# Altium schematic sheet E-14 ENET1.SchDoc: FRDM-IMX93
size 513 x 386 mm; DrawnBy: FORLINX; Organization: ORGANIZATION; Address1: ADDRESS 1; Address2: ADDRESS 2; Address3: ADDRESS 3; Address4: ADDRESS 4; Revision: -; ENG_APP_DATE: --/--/--; DSN_APP_DATE: --/--/--; CHK_APP_DATE: --/--/--; Classification: Public, Company Internal/Proprietary, Company Confidential,  Company Secret; Page Create Date: March  8, 1995; OrgName: NXP Semiconductor; FIUO: A; OrgAddr1: NO. 192 Liangjing Rd. Pudong New Area, ShangHai; Page Number: 14; PageTitle: ENET1; Page Size: C; Page Count: 23; Designer: FORLINX; RevCode: B1; Approver: NXP SE; Doc: SCH-94611 PDF: SPF-94611; DsnPath: T:\FILES\Designs\Single Board Computers\i.MX93-FRDM\Design Files\SCH-94611_B1.DSN; SchematicName: FRDM-i.MX 93 Development Board; PageName: E-14 ENET1; PageSize: C; TopSchematic: True
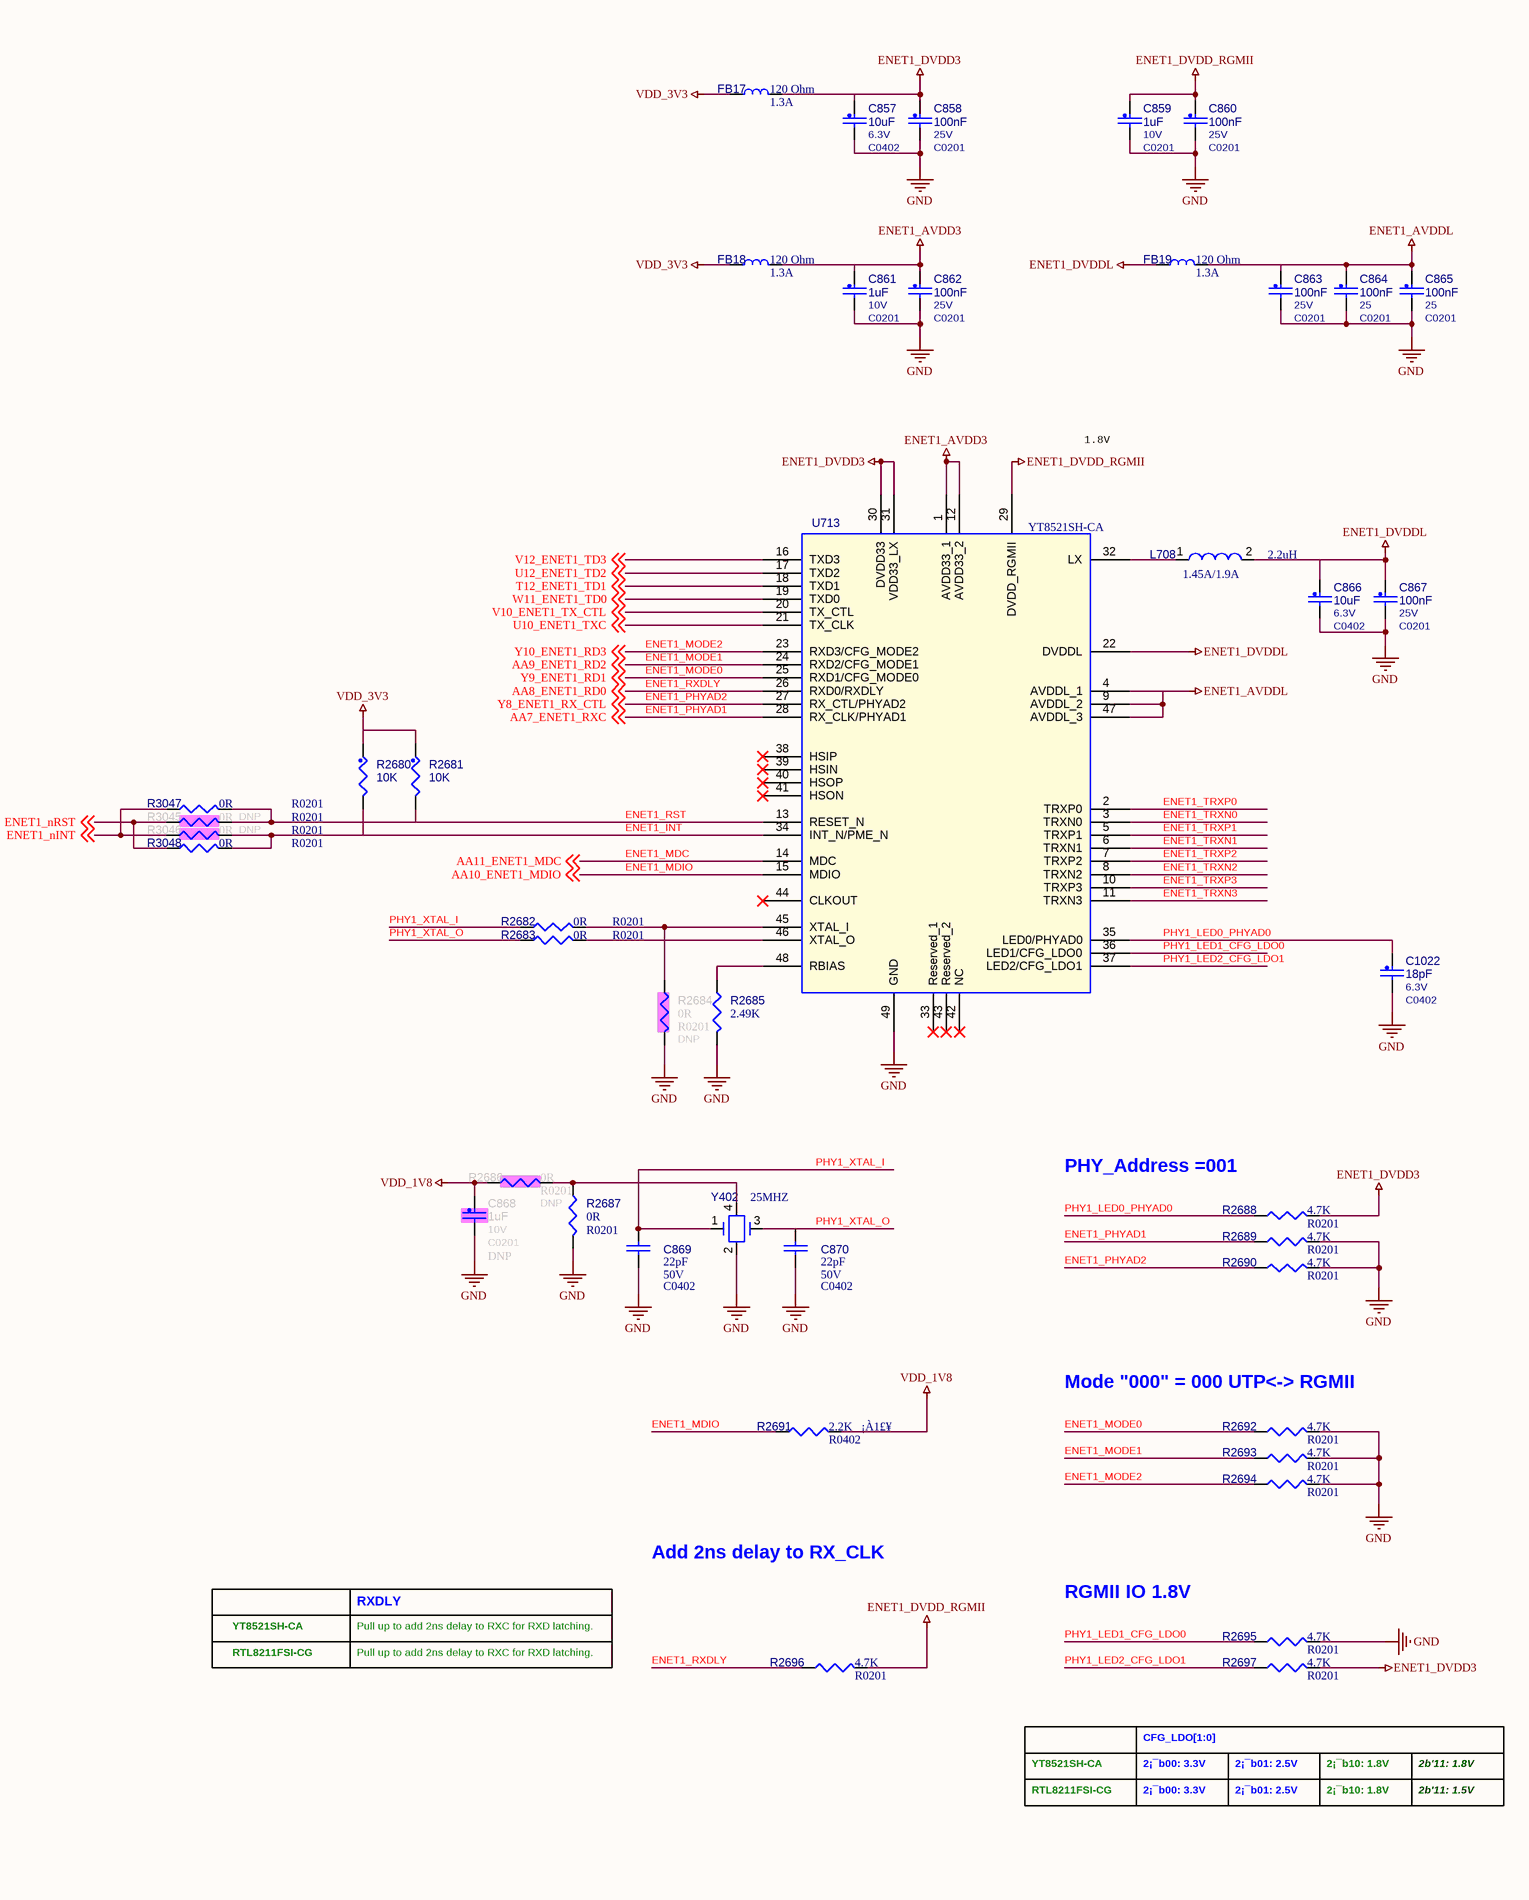
[diagram p0: E-14 ENET1.SchDoc, left]
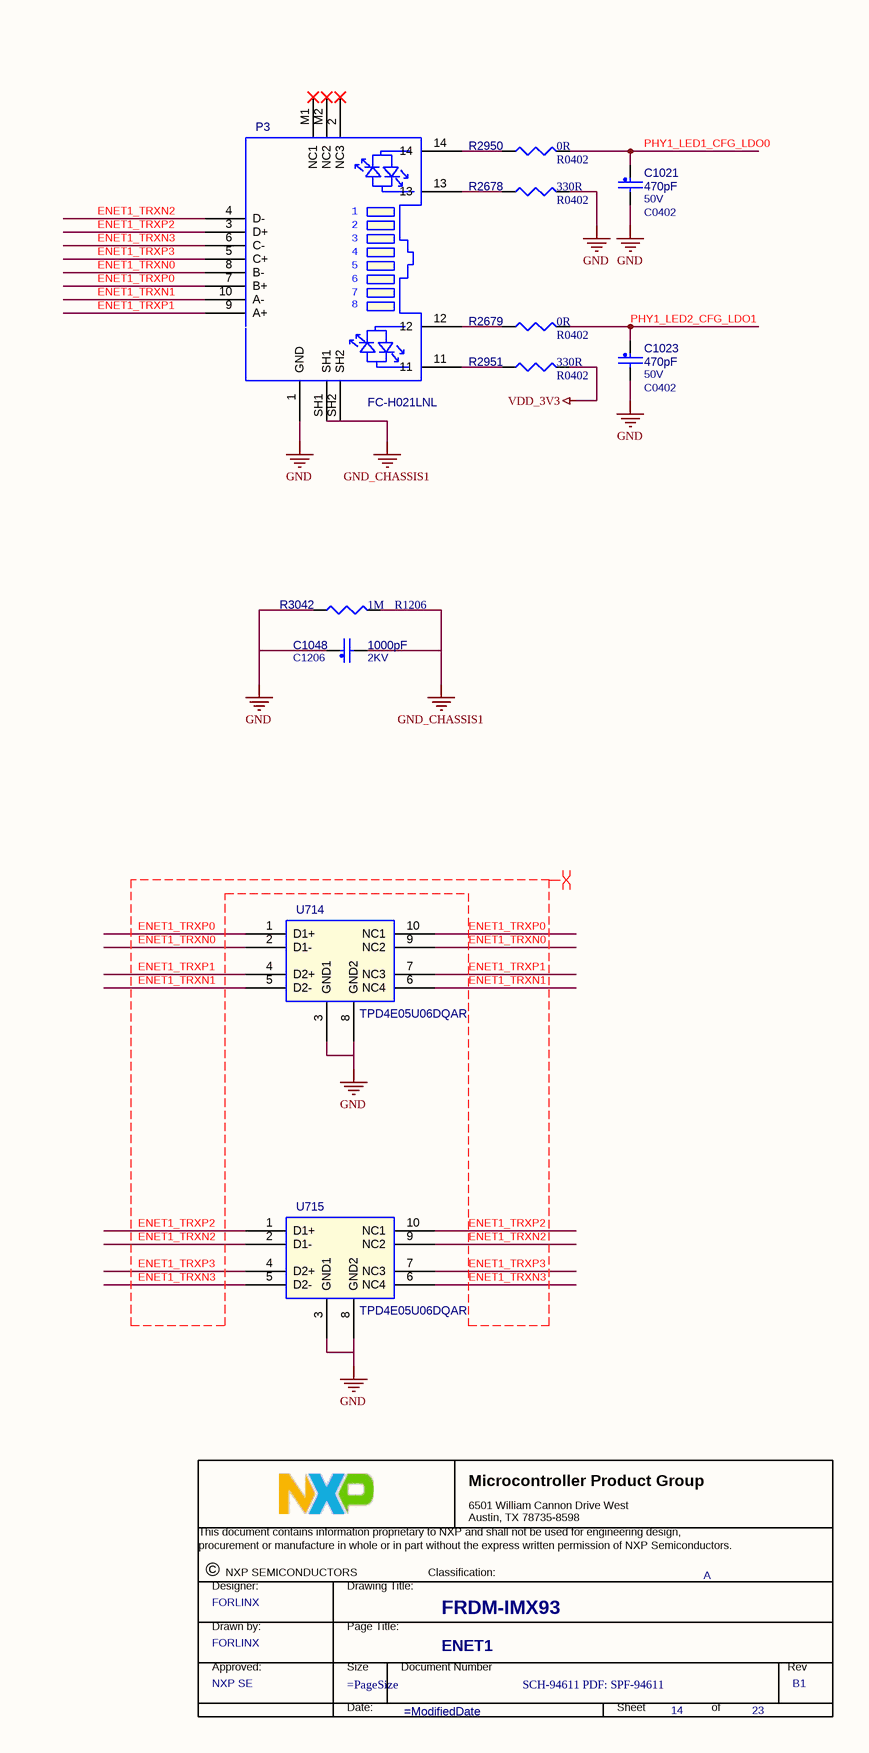
[diagram p1: E-14 ENET1.SchDoc, right]

## Parts
*  Title: FRDM-IMX93  RevCode: B1  PageTitle: ENET1  Page Number: 14  Page Count: 23  DrawnBy: FORLINX  Doc: SCH-94611 PDF: SPF-94611  Approver: NXP SE  FIUO: A  (graphical)
C857  10uF  VOLTAGE: 6.3V  [C0402]
C858  100nF  VOLTAGE: 25V  [C0201]
C859  1uF  VOLTAGE: 10V  [C0201]
C860  100nF  VOLTAGE: 25V  [C0201]
C861  1uF  VOLTAGE: 10V  [C0201]
C862  100nF  VOLTAGE: 25V  [C0201]
C863  100nF  VOLTAGE: 25V  [C0201]
C864  100nF  VOLTAGE: 25  [C0201]
C865  100nF  VOLTAGE: 25  [C0201]
C866  10uF  VOLTAGE: 6.3V  [C0402]
C867  100nF  VOLTAGE: 25V  [C0201]
C868  1uF  ASSY_OPT: DNP  VOLTAGE: 10V  [C0201]
C869  22pF  Voltage: 50V  [C0402]
C870  22pF  Voltage: 50V  [C0402]
C1021  470pF  VOLTAGE: 50V  [C0402]
C1022  18pF  VOLTAGE: 6.3V  [C0402]
C1023  470pF  VOLTAGE: 50V  [C0402]
C1048  1000pF  VOLTAGE: 2KV  [C1206]
FB17  120 Ohm  electric current: 1.3A  [FB0402]
FB18  120 Ohm  electric current: 1.3A  [FB0402]
FB19  120 Ohm  electric current: 1.3A  [FB0402]
L708  2.2uH  electric current: 1.45A/1.9A  [IND_2016A]
P3  FC-H021LNL  [RJ45-Gigabit]
R2678  330R  [R0402]
R2679  0R  [R0402]
R2680  10K  [R0201]
R2681  10K  [R0201]
R2682  0R  [R0201]
R2683  0R  [R0201]
R2684  0R  ASSY_OPT: DNP  [R0201]
R2685  2.49K  [R0402]
R2686  0R  ASSY_OPT: DNP  [R0201]
R2687  0R  [R0201]
R2688  4.7K  [R0201]
R2689  4.7K  [R0201]
R2690  4.7K  [R0201]
R2691  2.2K  precision: ¡À1£¥  [R0402]
R2692  4.7K  [R0201]
R2693  4.7K  [R0201]
R2694  4.7K  [R0201]
R2695  4.7K  [R0201]
R2696  4.7K  [R0201]
R2697  4.7K  [R0201]
R2950  0R  [R0402]
R2951  330R  [R0402]
R3042  1M  [R1206]
R3045  0R  ASSY_OPT: DNP  [R0201]
R3046  0R  ASSY_OPT: DNP  [R0201]
R3047  0R  [R0201]
R3048  0R  [R0201]
U713  YT8521SH-CA  [QFN48P_0_4BSC_6x6_H]
U714  TPD4E05U06DQAR  [USON-10]
U715  TPD4E05U06DQAR  [USON-10]
Y402  25MHZ  [xtlosc4_3p2x2p5mm_sm]

## Nets
ENET1_AVDD3: C861.1 C862.1 FB18.2 U713.1(AVDD33_1) U713.12(AVDD33_2)
ENET1_AVDDL: C863.1 C864.1 C865.1 FB19.2 U713.4(AVDDL_1) U713.9(AVDDL_2) U713.47(AVDDL_3)
ENET1_DVDD3: C857.1 C858.1 FB17.2 R2688.2 R2697.2 U713.30(DVDD33) U713.31(VDD33_LX)
ENET1_DVDD_RGMII: C859.1 C860.1 R2696.2 U713.29(DVDD_RGMII)
ENET1_DVDDL: C866.1 C867.1 FB19.1 L708.2 U713.22(DVDDL)
GND: C857.2 C858.2 C859.2 C860.2 C861.2 C862.2 C863.2 C864.2 C865.2 C866.2 C867.2 C868.2 C869.2 C870.2 C1021.2 C1022.2 C1023.2 C1048.1 P3.1(GND) R2678.2 R2684.2 R2685.2 R2687.2 R2689.2 R2690.2 R2692.2 R2693.2 R2694.2 R2695.2 R3042.1 U713.49(GND) U714.3(GND1) U714.8(GND2) U715.3(GND1) U715.8(GND2) Y402.2
GND_CHASSIS1: C1048.2 P3.SH1 P3.SH2 R3042.2
VDD_1V8: C868.1 R2686.1 R2691.2
VDD_3V3: FB17.1 FB18.1 R2680.1 R2681.1 R2951.2
ENET1_INT: R2680.2 R3046.2 R3048.2 U713.34(INT_N/PME_N)
ENET1_MDC: U713.14(MDC) ; off-sheet AA11_ENET1_MDC  [also labelled AA11_ENET1_MDC]
ENET1_MDIO: R2691.1 U713.15(MDIO) ; off-sheet AA10_ENET1_MDIO  [also labelled AA10_ENET1_MDIO]
ENET1_MODE0: R2692.1 U713.25(RXD1/CFG_MODE0) ; off-sheet Y9_ENET1_RD1  [also labelled Y9_ENET1_RD1]
ENET1_MODE1: R2693.1 U713.24(RXD2/CFG_MODE1) ; off-sheet AA9_ENET1_RD2  [also labelled AA9_ENET1_RD2]
ENET1_MODE2: R2694.1 U713.23(RXD3/CFG_MODE2) ; off-sheet Y10_ENET1_RD3  [also labelled Y10_ENET1_RD3]
ENET1_nINT: R3046.1 R3047.1 ; off-sheet ENET1_nINT
ENET1_nRST: R3045.1 R3048.1 ; off-sheet ENET1_nRST
ENET1_PHYAD1: R2689.1 U713.28(RX_CLK/PHYAD1) ; off-sheet AA7_ENET1_RXC  [also labelled AA7_ENET1_RXC]
ENET1_PHYAD2: R2690.1 U713.27(RX_CTL/PHYAD2) ; off-sheet Y8_ENET1_RX_CTL  [also labelled Y8_ENET1_RX_CTL]
ENET1_RST: R2681.2 R3045.2 R3047.2 U713.13(RESET_N)
ENET1_RXDLY: R2696.1 U713.26(RXD0/RXDLY) ; off-sheet AA8_ENET1_RD0  [also labelled AA8_ENET1_RD0]
ENET1_TRXN0: P3.8(B-) U713.3(TRXN0) U714.2(D1-) U714.9(NC2)
ENET1_TRXN1: P3.10(A-) U713.6(TRXN1) U714.5(D2-) U714.6(NC4)
ENET1_TRXN2: P3.4(D-) U713.8(TRXN2) U715.2(D1-) U715.9(NC2)
ENET1_TRXN3: P3.6(C-) U713.11(TRXN3) U715.5(D2-) U715.6(NC4)
ENET1_TRXP0: P3.7(B+) U713.2(TRXP0) U714.1(D1+) U714.10(NC1)
ENET1_TRXP1: P3.9(A+) U713.5(TRXP1) U714.4(D2+) U714.7(NC3)
ENET1_TRXP2: P3.3(D+) U713.7(TRXP2) U715.1(D1+) U715.10(NC1)
ENET1_TRXP3: P3.5(C+) U713.10(TRXP3) U715.4(D2+) U715.7(NC3)
PHY1_LED0_PHYAD0: C1022.1 R2688.1 U713.35(LED0/PHYAD0)
PHY1_LED1_CFG_LDO0: C1021.1 R2695.1 R2950.2 U713.36(LED1/CFG_LDO0)
PHY1_LED2_CFG_LDO1: C1023.1 R2679.2 R2697.1 U713.37(LED2/CFG_LDO1)
PHY1_XTAL_I: C869.1 R2682.1 Y402.1
PHY1_XTAL_O: C870.1 R2683.1 Y402.3
T12_ENET1_TD1: U713.18(TXD1) ; off-sheet T12_ENET1_TD1
U10_ENET1_TXC: U713.21(TX_CLK) ; off-sheet U10_ENET1_TXC
U12_ENET1_TD2: U713.17(TXD2) ; off-sheet U12_ENET1_TD2
V10_ENET1_TX_CTL: U713.20(TX_CTL) ; off-sheet V10_ENET1_TX_CTL
V12_ENET1_TD3: U713.16(TXD3) ; off-sheet V12_ENET1_TD3
W11_ENET1_TD0: U713.19(TXD0) ; off-sheet W11_ENET1_TD0
NetL708_1: L708.1 U713.32(LX)
NetP3_11: P3.11 R2951.1
NetP3_12: P3.12 R2679.1
NetP3_13: P3.13 R2678.1
NetP3_14: P3.14 R2950.1
NetR2682_2: R2682.2 R2684.1 U713.45(XTAL_I)
NetR2683_2: R2683.2 U713.46(XTAL_O)
NetR2685_1: R2685.1 U713.48(RBIAS)
NetR2686_2: R2686.2 R2687.1 Y402.4

Not connected (* = marked no-connect by the designer): P3 2(NC3)* M1(NC1)* M2(NC2)*; U713 33(Reserved_1)* 38(HSIP)* 39(HSIN)* 40(HSOP)* 41(HSON)* 42(NC)* 43(Reserved_2)* 44(CLKOUT)*

## Layout directives
differential pair: ENET1_TRXN0, ENET1_TRXN1, ENET1_TRXN2, ENET1_TRXN3, ENET1_TRXP0, ENET1_TRXP1, ENET1_TRXP2, ENET1_TRXP3

## Notes on the sheet
- 1.8V
- PHY_Address =001
- (near R2692) Mode "000" = 000 UTP<-> RGMII
- Add 2ns delay to RX_CLK
- YT8521SH-CA
- RXDLY
- Pull up to add 2ns delay to RXC for RXD latching.
- RGMII IO 1.8V
- RTL8211FSI-CG
- CFG_LDO[1:0]
- 2¡¯b00: 3.3V
- 2¡¯b01: 2.5V
- 2¡¯b10: 1.8V
- 2b'11: 1.8V
- 2b'11: 1.5V
- DWG. NO.
- REV.
- SHT.
- REVISION
- DESCRIPTION
- DATE
- APPROVED
- ENG:
- APPROVALS
- quilter.ai <http://quilter.ai>
- DSN:
- CHK:
- REFERENCE DOCUMENTS
- TITLE
- PROJECT
- BOM:
- FAB DWG:
- PCB DWG:
- ASSY DWG:
- SIZE
- FILE NAME
- C
- DWG NO.
- SHEET
- OF
- REV
- (in symbol TitleBlock_MCPG) Microcontroller Product Group; 6501 William Cannon Drive West / Austin, TX 78735-8598; This document contains information proprietary to NXP and shall not be used for engineering design,; procurement or manufacture in whole or in part without the express written permission of NXP Semiconductors.; ©; NXP SEMICONDUCTORS; Classification:; Designer:; Drawing Title:; Drawn by:; Page Title:; Approved:; Size; Document Number; Rev; Date:; Sheet; of

## Library data of the parts
* = TitleBlock_MCPG: Classification: Public, Company Internal/Proprietary, Company Confidential,  Company Secret; OrgAddr1: NO. 192 Liangjing Rd. Pudong New Area, ShangHai; OrgName: NXP Semiconductor; Page Size: =PageSize; Page Create Date: March  8, 1995; Designer: FORLINX; Page Modify Date: =ModifiedDate
C857 = CAP_NP: 0402,10uF,6.3V,+/-20%,X5R; Part Reference: C857; CLASS: DISCRETE; Tolerance: 20%; MFG_NAME01: FENGHUA; MFG_PN01: 0402X106M6R3NT; CAD_APPROVED: Yes; FPLIST: CC0402_25,CC0402_HD,0402_CC; Value: 10uF; ROHS: Yes; HEIGHT: 0.65 MM; PCB Footprint: C0402
C858 = CAP_NP: 0201,100nF,25V,+/-10%,X5R; Part Reference: C858; CLASS: DISCRETE; FPLIST: CC0402_25,CC0402_HD,0402_CC; CAD_APPROVED: Yes; MFG_PN01: 0201X104K250NT; MFG_NAME01: FENGHUA; Tolerance: 20%; Value: 100nF; HEIGHT: 0.65 MM; ROHS: Yes; PCB Footprint: C0201
C859 = CAP_NP: 0201,1uF,10V,+/-20%,X5R; Part Reference: C859; CLASS: DISCRETE; FPLIST: CC0201,CC0201_HD,0201_CC,0201_CC_012SM_NSP; CAD_APPROVED: Yes; MFG_PN01: CL03A105MP3NSNC; MFG_NAME01: SAMSUNG; Tolerance: 20%; Value: 1uF; Package Type: 7¡± reel; Package Size: 0201; HEIGHT: 0.35MM; ROHS: Yes; PCB Footprint: C0201
C860 = CAP_NP: 0201,100nF,25V,+/-10%,X5R; Part Reference: C860; CLASS: DISCRETE; Tolerance: 20%; MFG_NAME01: FENGHUA; MFG_PN01: 0201X104K250NT; CAD_APPROVED: Yes; FPLIST: CC0402_25,CC0402_HD,0402_CC; Value: 100nF; ROHS: Yes; HEIGHT: 0.65 MM; PCB Footprint: C0201
C861 = CAP_NP: 0201,1uF,10V,+/-20%,X5R; Part Reference: C861; CLASS: DISCRETE; Tolerance: 20%; MFG_NAME01: SAMSUNG; MFG_PN01: CL03A105MP3NSNC; CAD_APPROVED: Yes; FPLIST: CC0201,CC0201_HD,0201_CC,0201_CC_012SM_NSP; Value: 1uF; ROHS: Yes; HEIGHT: 0.35MM; Package Size: 0201; Package Type: 7¡± reel; PCB Footprint: C0201
C862 = CAP_NP: 0201,100nF,25V,+/-10%,X5R; Part Reference: C862; CLASS: DISCRETE; Tolerance: 20%; MFG_NAME01: FENGHUA; MFG_PN01: 0201X104K250NT; CAD_APPROVED: Yes; FPLIST: CC0402_25,CC0402_HD,0402_CC; Value: 100nF; ROHS: Yes; HEIGHT: 0.65 MM; PCB Footprint: C0201
C863 = CAP_NP: 0201,100nF,25V,+/-10%,X5R; Part Reference: C863; CLASS: DISCRETE; FPLIST: CC0402_25,CC0402_HD,0402_CC; CAD_APPROVED: Yes; MFG_PN01: 0201X104K250NT; MFG_NAME01: FENGHUA; Tolerance: 20%; Value: 100nF; HEIGHT: 0.65 MM; ROHS: Yes; PCB Footprint: C0201
C864 = CAP_NP: 0201,100nF,25V,+/-10%,X5R; Part Reference: C864; CLASS: DISCRETE; FPLIST: CC0402_25,CC0402_HD,0402_CC; CAD_APPROVED: Yes; MFG_PN01: 0201X104K250NT; MFG_NAME01: FENGHUA; Tolerance: 20%; Value: 100nF; HEIGHT: 0.65 MM; ROHS: Yes; PCB Footprint: C0201
C865 = CAP_NP: 0201,100nF,25V,+/-10%,X5R; Part Reference: C865; CLASS: DISCRETE; Tolerance: 20%; MFG_NAME01: FENGHUA; MFG_PN01: 0201X104K250NT; CAD_APPROVED: Yes; FPLIST: CC0402_25,CC0402_HD,0402_CC; Value: 100nF; ROHS: Yes; HEIGHT: 0.65 MM; PCB Footprint: C0201
C866 = CAP_NP: 0402,10uF,6.3V,+/-20%,X5R; Part Reference: C866; CLASS: DISCRETE; FPLIST: CC0402_25,CC0402_HD,0402_CC; CAD_APPROVED: Yes; MFG_PN01: 0402X106M6R3NT; MFG_NAME01: FENGHUA; Tolerance: 20%; Value: 10uF; HEIGHT: 0.65 MM; ROHS: Yes; PCB Footprint: C0402
C867 = CAP_NP: 0201,100nF,25V,+/-10%,X5R; Part Reference: C867; CLASS: DISCRETE; Tolerance: 20%; MFG_NAME01: FENGHUA; MFG_PN01: 0201X104K250NT; CAD_APPROVED: Yes; FPLIST: CC0402_25,CC0402_HD,0402_CC; Value: 100nF; ROHS: Yes; HEIGHT: 0.65 MM; PCB Footprint: C0201
C868 = CAP_NP: 0201,1uF,10V,+/-20%,X5R; Part Reference: C868; CLASS: DISCRETE; Tolerance: 20%; MFG_NAME01: SAMSUNG; MFG_PN01: CL03A105MP3NSNC; CAD_APPROVED: Yes; FPLIST: CC0201,CC0201_HD,0201_CC,0201_CC_012SM_NSP; Value: 1uF; ROHS: Yes; HEIGHT: 0.35MM; Package Size: 0201; Package Type: 7¡± reel; PCB Footprint: C0201
C869 = C0402,22pF: 0402,22pF,50V,+/-5%,NPO; Part Reference: C869; serial number: 1110202003; MFG_NAME01: FENGHUA; MFG_PN01: 0402CG220J500NT; PCB Footprint: C0402; Value: 22pF
C870 = C0402,22pF: 0402,22pF,50V,+/-5%,NPO; Part Reference: C870; serial number: 1110202003; MFG_NAME01: FENGHUA; MFG_PN01: 0402CG220J500NT; PCB Footprint: C0402; Value: 22pF
C1021 = CAP_NP: 0402,470pF,50V,+/-5%,NPO; Part Reference: C1021; CLASS: DISCRETE; FPLIST: CC0402_25,CC0402_HD,0402_CC; CAD_APPROVED: Yes; MFG_PN01: 0402CG471J500NT; MFG_NAME01: FENGHUA; Tolerance: 20%; Value: 470pF; HEIGHT: 0.65 MM; ROHS: Yes; PCB Footprint: C0402
C1022 = CAP_NP: 0402,18pF,50V,+/-5%,NPO; Part Reference: C1022; CLASS: DISCRETE; Tolerance: 20%; MFG_NAME01: FENGHUA; MFG_PN01: 0402B103K500NT; CAD_APPROVED: Yes; FPLIST: CC0402_25,CC0402_HD,0402_CC; Value: 18pF; ROHS: Yes; HEIGHT: 0.65 MM; PCB Footprint: C0402
C1023 = CAP_NP: 0402,470pF,50V,+/-5%,NPO; Part Reference: C1023; CLASS: DISCRETE; FPLIST: CC0402_25,CC0402_HD,0402_CC; CAD_APPROVED: Yes; MFG_PN01: 0402CG471J500NT; MFG_NAME01: FENGHUA; Tolerance: 20%; Value: 470pF; HEIGHT: 0.65 MM; ROHS: Yes; PCB Footprint: C0402
C1048 = CAP_NP: 1206,1nF,2KV,+/-10%; Part Reference: C1048; CLASS: DISCRETE; Tolerance: 20%; MFG_NAME01: FENGHUA; MFG_PN01: 1206B102K202NT; CAD_APPROVED: Yes; FPLIST: CC0402_25,CC0402_HD,0402_CC; Value: 1000pF; ROHS: Yes; HEIGHT: 0.65 MM; PCB Footprint: C1206
FB17 = FB0402,120ohm,1.3A: 0402,120Ohm@100MHz,2A; Part Reference: FB17; serial number: 1110304038; MFG_NAME01: Murata; MFG_PN01: BLM15PX121SN1D; PCB Footprint: FB0402; Value: 120 Ohm
FB18 = FB0402,120ohm,1.3A: 0402,120Ohm@100MHz,2A; Part Reference: FB18; serial number: 1110304038; MFG_NAME01: Murata; MFG_PN01: BLM15PX121SN1D; PCB Footprint: FB0402; Value: 120 Ohm
FB19 = FB0402,120ohm,1.3A: 0402,120Ohm@100MHz,2A; Part Reference: FB19; serial number: 1110304038; MFG_NAME01: Murata; MFG_PN01: BLM15PX121SN1D; PCB Footprint: FB0402; Value: 120 Ohm
L708 = INDUCTOR-WPN201612HR47MT: 2.2uH,2*1.6*1mm,2.15A; Part Reference: L708; serial number: 1110301115; MFG_NAME01: Sunlord; MFG_PN01: WPN201610H2R2MT; Value: 2.2uH; PCB Footprint: IND_2016A
P3 = FC-H021LNL_2: HR851178A,RJ45,1000M; Part Reference: P3; MFG_NAME01: Hanrun; Value: FC-H021LNL; MFG_PN01: HR851178A; PCB Footprint: RJ45-Gigabit
R2678 = R0402,4.7K_Dup1: 0402,330Ohm,+/-1%; Part Reference: R2678; precision: ¡À1£¥; serial number: 1110102015; MFG_NAME01: FENGHUA; MFG_PN01: RC-02W3300FT; PCB Footprint: R0402; Value: 330R
R2679 = R0402,4.7K_Dup1: 0402,0Ohm,+/-1%; Part Reference: R2679; precision: ¡À1£¥; serial number: 1110102015; MFG_NAME01: FENGHUA; MFG_PN01: RC-02000FT; PCB Footprint: R0402; Value: 0R
R2680 = RES: 0201,10K,+/-5%; Part Reference: R2680; CLASS: DISCRETE; FPLIST: RC0402_25,RC0402_HD,RC0402_X2,0402_CC,CAPC0402_L; CAD_APPROVED: Yes; MFG_PN01: RC-01W103JT; MFG_NAME01: FENGHUA; Tolerance: 5%; Value: 10K; ROHS: Yes; TOL: 5%; HEIGHT: 0.41mm; PCB Footprint: R0201
R2681 = RES: 0201,10K,+/-5%; Part Reference: R2681; CLASS: DISCRETE; FPLIST: RC0402_25,RC0402_HD,RC0402_X2,0402_CC,CAPC0402_L; CAD_APPROVED: Yes; MFG_PN01: RC-01W103JT; MFG_NAME01: FENGHUA; Tolerance: 5%; Value: 10K; ROHS: Yes; TOL: 5%; HEIGHT: 0.41mm; PCB Footprint: R0201
R2682 = R0402,1.5K: 0201,0Ohm,+/-5%; Part Reference: R2682; serial number: 1110102060; precision: ¡À1£¥; MFG_NAME01: FENGHUA; MFG_PN01: RC-01000JT; PCB Footprint: R0201; Value: 0R
R2683 = R0402,1.5K: 0201,0Ohm,+/-5%; Part Reference: R2683; serial number: 1110102060; precision: ¡À1£¥; MFG_NAME01: FENGHUA; MFG_PN01: RC-01000JT; PCB Footprint: R0201; Value: 0R
R2684 = R0402,1.5K: 0201,0Ohm,+/-5%; Part Reference: R2684; serial number: 1110102060; precision: ¡À1£¥; MFG_PN01: RC-01000JT; MFG_NAME01: FENGHUA; PCB Footprint: R0201; Value: 0R
R2685 = R0402,2.49K: 0402,2.49K,+/-1%; Part Reference: R2685; precision: ¡À1£¥; serial number: 1110102182; MFG_NAME01: FENGHUA; MFG_PN01: RC-02W2491FT; PCB Footprint: R0402; Value: 2.49K
R2686 = R0402,1.5K: 0201,0Ohm,+/-5%; Part Reference: R2686; serial number: 1110102060; precision: ¡À1£¥; MFG_NAME01: FENGHUA; MFG_PN01: RC-01000JT; PCB Footprint: R0201; Value: 0R
R2687 = R0402,1.5K: 0201,0Ohm,+/-5%; Part Reference: R2687; serial number: 1110102060; precision: ¡À1£¥; MFG_NAME01: FENGHUA; MFG_PN01: RC-01000JT; PCB Footprint: R0201; Value: 0R
R2688 = R0402,4.7K_Dup1: 0201,4.7K,+/-1%; Part Reference: R2688; precision: ¡À1£¥; serial number: 1110102015; MFG_NAME01: FENGHUA; MFG_PN01: RC-01W4701FT; PCB Footprint: R0201; Value: 4.7K
R2689 = R0402,4.7K_Dup1: 0201,4.7K,+/-1%; Part Reference: R2689; precision: ¡À1£¥; serial number: 1110102015; MFG_NAME01: FENGHUA; MFG_PN01: RC-01W4701FT; PCB Footprint: R0201; Value: 4.7K
R2690 = R0402,4.7K_Dup1: 0201,4.7K,+/-1%; Part Reference: R2690; precision: ¡À1£¥; serial number: 1110102015; MFG_NAME01: FENGHUA; MFG_PN01: RC-01W4701FT; PCB Footprint: R0201; Value: 4.7K
R2691 = R0402,1.5K: 0402,2.2K,+/-1%; Part Reference: R2691; serial number: 1110102060; MFG_NAME01: FENGHUA; MFG_PN01: RC-02K2201FT; PCB Footprint: R0402; Value: 2.2K
R2692 = R0402,4.7K_Dup1: 0201,4.7K,+/-1%; Part Reference: R2692; precision: ¡À1£¥; serial number: 1110102015; MFG_NAME01: FENGHUA; MFG_PN01: RC-01W4701FT; PCB Footprint: R0201; Value: 4.7K
R2693 = R0402,4.7K_Dup1: 0201,4.7K,+/-1%; Part Reference: R2693; precision: ¡À1£¥; serial number: 1110102015; MFG_NAME01: FENGHUA; MFG_PN01: RC-01W4701FT; PCB Footprint: R0201; Value: 4.7K
R2694 = R0402,4.7K_Dup1: 0201,4.7K,+/-1%; Part Reference: R2694; precision: ¡À1£¥; serial number: 1110102015; MFG_NAME01: FENGHUA; MFG_PN01: RC-01W4701FT; PCB Footprint: R0201; Value: 4.7K
R2695 = R0402,4.7K_Dup1: 0201,4.7K,+/-1%; Part Reference: R2695; precision: ¡À1£¥; serial number: 1110102015; MFG_NAME01: FENGHUA; MFG_PN01: RC-01W4701FT; PCB Footprint: R0201; Value: 4.7K
R2696 = R0402,4.7K_Dup1: 0201,4.7K,+/-1%; Part Reference: R2696; precision: ¡À1£¥; serial number: 1110102015; MFG_NAME01: FENGHUA; MFG_PN01: RC-01W4701FT; PCB Footprint: R0201; Value: 4.7K
R2697 = R0402,4.7K_Dup1: 0201,4.7K,+/-1%; Part Reference: R2697; precision: ¡À1£¥; serial number: 1110102015; MFG_NAME01: FENGHUA; MFG_PN01: RC-01W4701FT; PCB Footprint: R0201; Value: 4.7K
R2950 = R0402,4.7K_Dup1: 0402,0Ohm,+/-1%; Part Reference: R2950; precision: ¡À1£¥; serial number: 1110102015; MFG_NAME01: FENGHUA; MFG_PN01: RC-02000FT; PCB Footprint: R0402; Value: 0R
R2951 = R0402,4.7K_Dup1: 0402,330Ohm,+/-1%; Part Reference: R2951; precision: ¡À1£¥; serial number: 1110102015; MFG_NAME01: FENGHUA; MFG_PN01: RC-02W3300FT; PCB Footprint: R0402; Value: 330R
R3042 = R0402,4.7K_Dup1: 1206,1M,+/-5%; Part Reference: R3042; precision: ¡À1£¥; serial number: 1110102015; MFG_NAME01: FENGHUA; MFG_PN01: RS-06K105JT; PCB Footprint: R1206; Value: 1M
R3045 = R0402,1.5K: 0201,0Ohm,+/-5%; Part Reference: R3045; serial number: 1110102060; precision: ¡À1£¥; MFG_NAME01: FENGHUA; MFG_PN01: RC-01000JT; PCB Footprint: R0201; Value: 0R
R3046 = R0402,1.5K: 0201,0Ohm,+/-5%; Part Reference: R3046; serial number: 1110102060; precision: ¡À1£¥; MFG_NAME01: FENGHUA; MFG_PN01: RC-01000JT; PCB Footprint: R0201; Value: 0R
R3047 = R0402,1.5K: 0201,0Ohm,+/-5%; Part Reference: R3047; serial number: 1110102060; precision: ¡À1£¥; MFG_NAME01: FENGHUA; MFG_PN01: RC-01000JT; PCB Footprint: R0201; Value: 0R
R3048 = R0402,1.5K: 0201,0Ohm,+/-5%; Part Reference: R3048; serial number: 1110102060; precision: ¡À1£¥; MFG_NAME01: FENGHUA; MFG_PN01: RC-01000JT; PCB Footprint: R0201; Value: 0R
U713 = YT8521SH-CA: Part Reference: U713; MFG_NAME01: MotorComm; Value: YT8521SH-CA; MFG_PN01: YT8521SH-CA; PCB Footprint: QFN48P_0_4BSC_6x6_H
U714 = TPD4E05U06DQAR_6: TPD4E05U06DQAR,USON; Part Reference: U714; MFG_NAME01: TI; Value: TPD4E05U06DQAR; MFG_PN01: TPD4E05U06DQAR; PCB Footprint: USON-10
U715 = TPD4E05U06DQAR_7: TPD4E05U06DQAR,USON; Part Reference: U715; MFG_NAME01: TI; Value: TPD4E05U06DQAR; MFG_PN01: TPD4E05U06DQAR; PCB Footprint: USON-10
Y402 = CRYSTAL_4P-TSX-3225: Crystal,25MHZ,4P,3.2*2.5mm,+/-20ppm,20pf; Part Reference: Y402; serial number: 1110601039; MFG_NAME01: Dongxin Hengke; MFG_PN01: SE25000O33D; Value: 25MHZ; PCB Footprint: xtlosc4_3p2x2p5mm_sm